# Altium schematic sheet MercurialSDR_FTDI_Interface.SchDoc
size A4
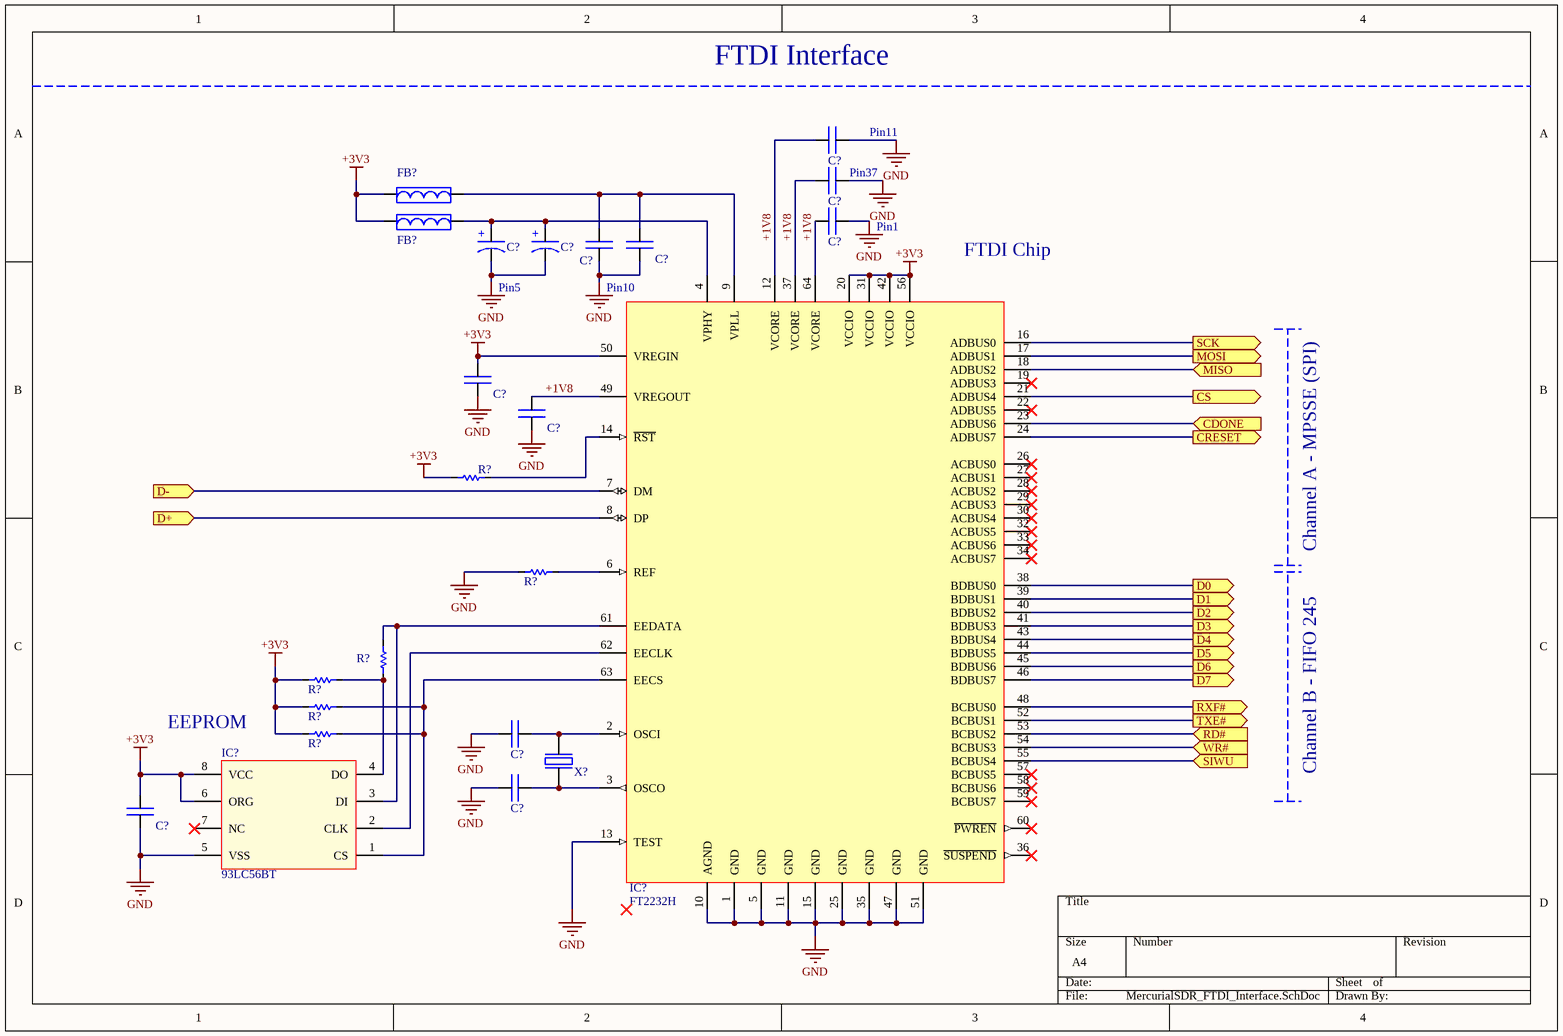
[diagram p0: MercurialSDR_FTDI_Interface.SchDoc]

## Parts
(Parts that share a designator on the sheet are numbered #1, #2 ... from top to bottom, then left to right.)
C?#1  Capacitor  [CAP_0603]  (value not drawn)
C?#2  Capacitor  [CAP_0603]  (value not drawn)
C?#3  Capacitor  [CAP_0603]  (value not drawn)
C?#4  Capacitor Polarizado  (value not drawn)
C?#5  Capacitor Polarizado  (value not drawn)
C?#6  Capacitor  [CAP_0603]  (value not drawn)
C?#7  Capacitor  [CAP_0603]  (value not drawn)
C?#8  Capacitor  [CAP_0603]  (value not drawn)
C?#9  Capacitor  [CAP_0603]  (value not drawn)
C?#10  Capacitor  [CAP_0603]  (value not drawn)
C?#11  Capacitor  [CAP_0603]  (value not drawn)
C?#12  Capacitor  [CAP_0603]  (value not drawn)
FB?#1  Ferrite Bead  [FERRITE_BEAD_0603]  (value not drawn)
FB?#2  Ferrite Bead  [FERRITE_BEAD_0603]  (value not drawn)
IC?#1  FT2232H  [LQFP_64]
IC?#2  93LC56BT
R?#1  Resistor SMD  [RES_0603]  (value not drawn)
R?#2  Resistor SMD  [RES_0603]  (value not drawn)
R?#3  Resistor SMD  [RES_0603]  (value not drawn)
R?#4  Resistor SMD  [RES_0603]  (value not drawn)
R?#5  Resistor SMD  [RES_0603]  (value not drawn)
R?#6  Resistor SMD  [RES_0603]  (value not drawn)
X?  XTAL  (value not drawn)

## Ports
CDONE (in), CRESET (out), CS (out), D0 (out), D1 (out), D2 (out), D3 (out), D4 (out), D5 (out), D6 (out), D7 (out), D+ (in), D- (in), MISO (in), MOSI (out), RD# (in), RXF# (out), SCK (out), SIWU (in), TXE# (out), WR# (in)

## Nets
+3V3: C?#8.1 C?#12.1 FB?#1.1 FB?#2.1 IC?#1.20(VCCIO) IC?#1.31(VCCIO) IC?#1.42(VCCIO) IC?#1.50(VREGIN) IC?#1.56(VCCIO) IC?#2.6(ORG) IC?#2.8(VCC) R?#1.2 R?#4.2 R?#5.1 R?#6.1
GND: C?#1.2 C?#2.2 C?#3.2 C?#4.2 C?#5.2 C?#6.2 C?#7.2 C?#8.2 C?#9.2 C?#10.2 C?#11.1 C?#12.2 IC?#1.1(GND) IC?#1.5(GND) IC?#1.10(AGND) IC?#1.11(GND) IC?#1.13(TEST) IC?#1.15(GND) IC?#1.25(GND) IC?#1.35(GND) IC?#1.47(GND) IC?#1.51(GND) IC?#2.5(VSS) R?#2.2
+1V8: C?#1.1 C?#2.1 C?#3.1 C?#9.1 IC?#1.12(VCORE) IC?#1.37(VCORE) IC?#1.49(VREGOUT) IC?#1.64(VCORE)
CDONE: IC?#1.23(ADBUS6) ; port CDONE
CRESET: IC?#1.24(ADBUS7) ; port CRESET
CS: IC?#1.21(ADBUS4) ; port CS
D0: IC?#1.38(BDBUS0) ; port D0
D1: IC?#1.39(BDBUS1) ; port D1
D2: IC?#1.40(BDBUS2) ; port D2
D3: IC?#1.41(BDBUS3) ; port D3
D4: IC?#1.43(BDBUS4) ; port D4
D5: IC?#1.44(BDBUS5) ; port D5
D6: IC?#1.45(BDBUS6) ; port D6
D7: IC?#1.46(BDBUS7) ; port D7
D+: IC?#1.8(DP) ; port D+
D-: IC?#1.7(DM) ; port D-
MISO: IC?#1.18(ADBUS2) ; port MISO
MOSI: IC?#1.17(ADBUS1) ; port MOSI
RD#: IC?#1.53(BCBUS2) ; port RD#
RXF#: IC?#1.48(BCBUS0) ; port RXF#
SCK: IC?#1.16(ADBUS0) ; port SCK
SIWU: IC?#1.55(BCBUS4) ; port SIWU
TXE#: IC?#1.52(BCBUS1) ; port TXE#
WR#: IC?#1.54(BCBUS3) ; port WR#
NetC?#4_1: C?#4.1 C?#5.1 FB?#2.2 IC?#1.4(VPHY)
NetC?#6_1: C?#6.1 C?#7.1 FB?#1.2 IC?#1.9(VPLL)
NetC?#10_1: C?#10.1 IC?#1.2(OSCI) X?.1
NetC?#11_2: C?#11.2 IC?#1.3(OSCO) X?.2
NetIC?#1_6: IC?#1.6(REF) R?#2.1
NetIC?#1_14: IC?#1.14(~{RST}) R?#1.1
NetIC?#1_61: IC?#1.61(EEDATA) IC?#2.3(DI) R?#3.2
NetIC?#1_62: IC?#1.62(EECLK) IC?#2.2(CLK)
NetIC?#1_63: IC?#1.63(EECS) IC?#2.1(CS) R?#5.2 R?#6.2
NetIC?#2_4: IC?#2.4(DO) R?#3.1 R?#4.1

Not connected (* = marked no-connect by the designer): IC?#1 19(ADBUS3)* 22(ADBUS5)* 26(ACBUS0)* 27(ACBUS1)* 28(ACBUS2)* 29(ACBUS3)* 30(ACBUS4)* 32(ACBUS5)* 33(ACBUS6)* 34(ACBUS7)* 36(~{SUSPEND})* 57(BCBUS5)* 58(BCBUS6)* 59(BCBUS7)* 60(~{PWREN})*; IC?#2 7(NC)*

## Notes on the sheet
- FTDI Interface
- (near C?#2) Pin37
- (near C?#1) Pin11
- (near C?#3) Pin1
- (near C?#4) Pin5
- (near IC?#1) Pin10
- (near IC?#1) FTDI Chip
- Channel A - MPSSE (SPI)
- (near IC?#2) EEPROM
- Channel B - FIFO 245
- (in symbol Cap Pol) +

## Library data of the parts
C?#1-C?#3 C?#6-C?#12 = Cap: Capacitor no polarizado; Value: *; Temp Coef: *; Part Number: *; VR: *; Material: *
C?#4 C?#5 = Cap Pol: Value: *; Temp Coef: *; Part Number: *; VR: *; Material: *
IC?#1 = FT2232H: USB bridge; Part Number: *
IC?#2 = 93LC56BT/SN: EEPROM SPI 2kb (128x16)
R?#1-R?#6 = Res: Resistor; Power: *; Part Number: *; Tolerance: *
X? = XTAL: Oscilador a Cristal; Frquency: *
FB?#1 FB?#2 = Ferrite Bead: Part Number: *; In: *